# Altium schematic sheet Distortion Pedal.SchDoc
size A
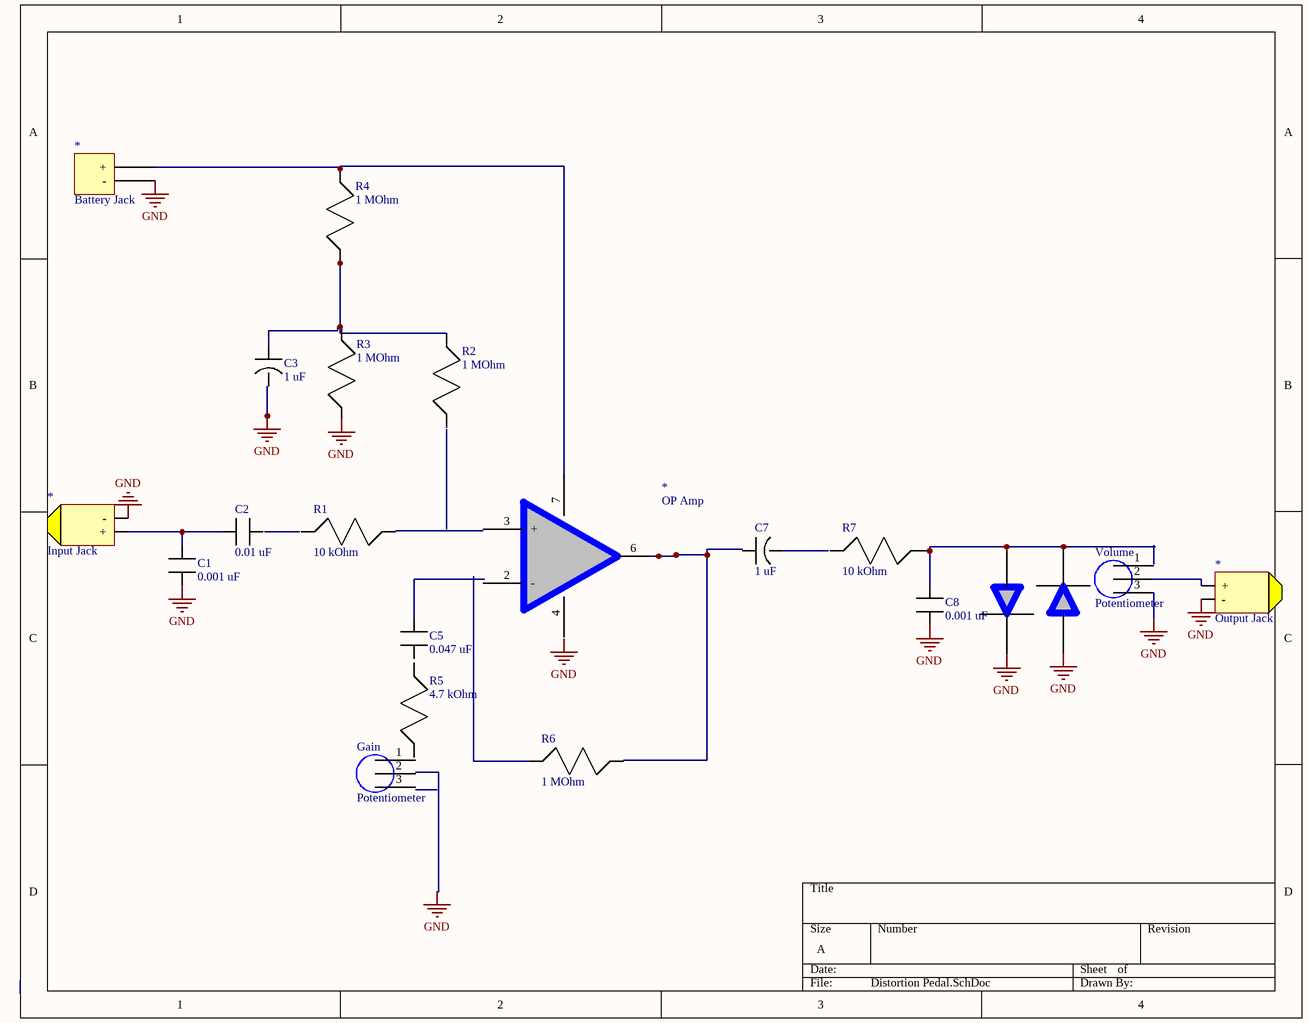
[diagram p0: Distortion Pedal.SchDoc]

## Parts
(Parts that share a designator on the sheet are numbered #1, #2 ... from top to bottom, then left to right.)
*#1  Battery Jack
*#2  Input Jack
*#3  OP Amp
*#4  Output Jack
C1  0.001 uF
C2  0.01 uF
C3  1 uF
C5  0.047 uF
C7  1 uF
C8  0.001 uF
D1  D1  (value not drawn)
D2  LED  (value not drawn)
Gain  Potentiometer
R1  10 kOhm
R2  1 MOhm
R3  1 MOhm
R4  1 MOhm
R5  4.7 kOhm
R6  1 MOhm
R7  10 kOhm
Volume  Potentiometer

## Nets
GND: *#1.8(-) *#2.2(-) *#4.2(-) C1.57 C8.56 D1.34 D2.33
Net*#2_1: *#2.1(+) C1.56 C2.56
Net*#3_7: *#3.7 R4.55
NetC8_57: C8.57 D1.33 D2.34 R7.55
NetR2_55: R2.55 R3.55 R4.54

Not connected (* = marked no-connect by the designer): *#1 1(+); *#3 2(-) 3(+) 4(45) 6; *#4 1(+); C2 57; C3 9 10; C5 56 57; C7 9 10; Gain 1(35) 2(36) 3(37); R1 54 55; R2 54; R3 54; R5 54 55; R6 54 55; R7 54; Volume 1(35) 2(36) 3(37)

## Notes on the sheet
- Labels drawn without touching a wire or pin: GND

## Library data of the parts
*#2 *#4 = Audio Jack
C1 C2 C5 C8 = Capacitor
C3 C7 = Polarized Capacitor
D1 = LED
R1-R7 = Resistor